# Altium schematic sheet living.SchDoc
size A3
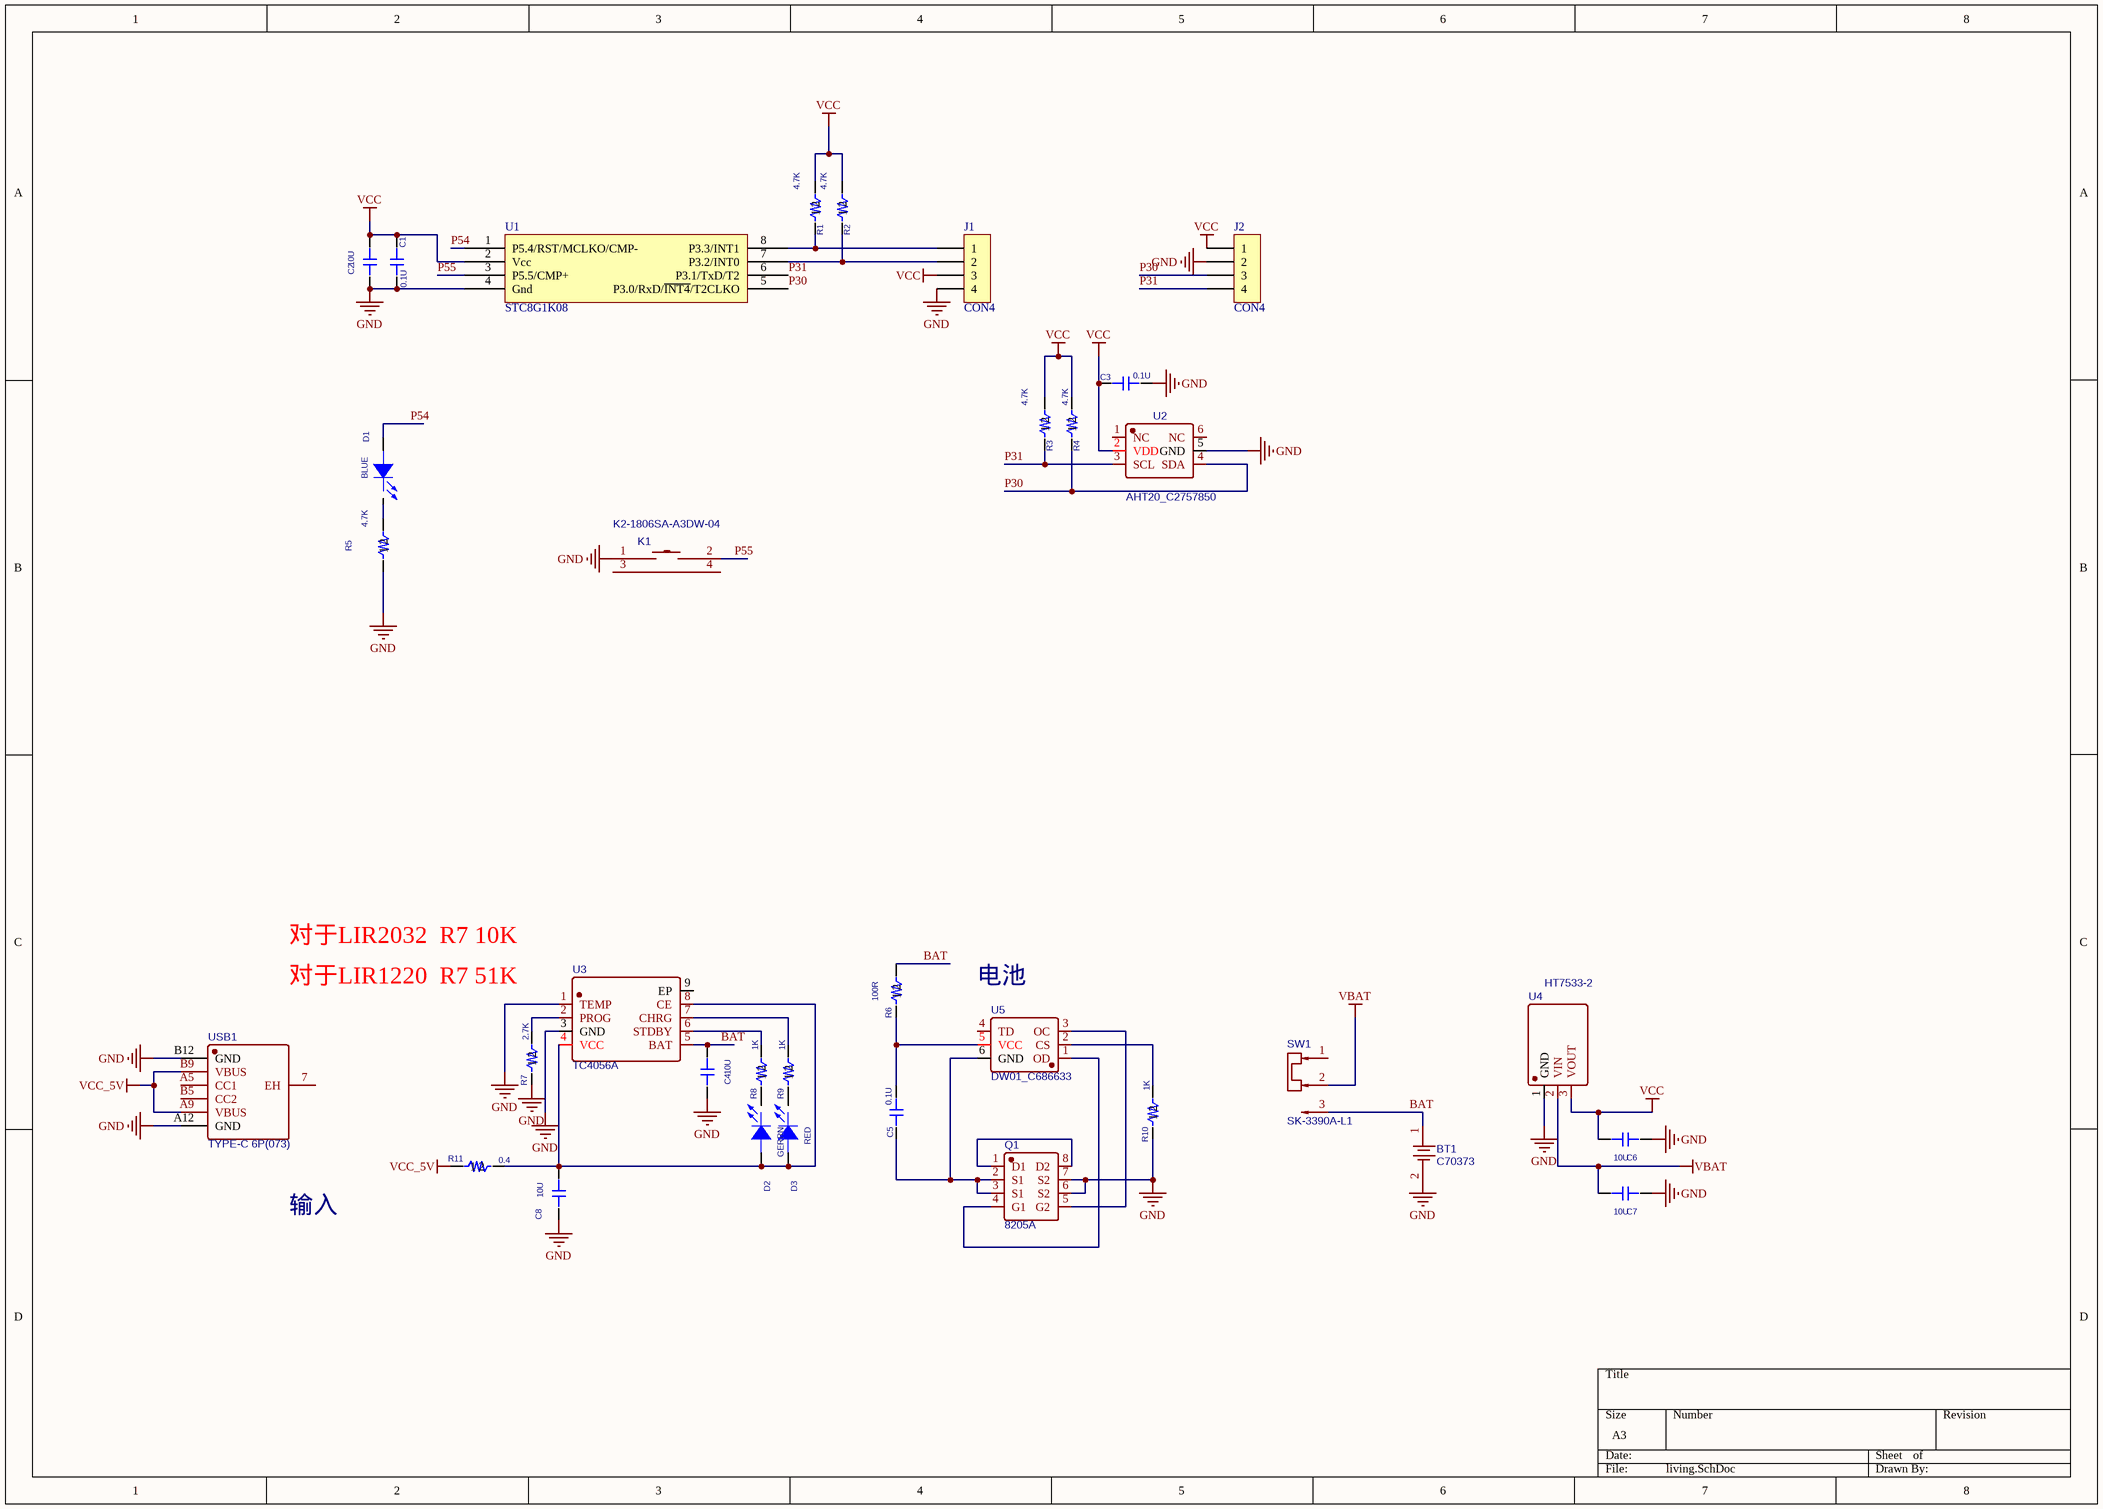
[diagram p0: living.SchDoc]

## Parts
BT1  C70373  [BAT-SMD_CR2032-3V]
C1  value 0.1U  [C_0603]  (hidden comment: C_0.1UF_0603)
C2  value 10U  [CAP_0603_FIRE]  (hidden comment: C_10UF_0603)
C3  value 0.1U  [C_0603]  (hidden comment: C_0.1UF_0603)
C4  value 10U  [CAP_0603_FIRE]  (hidden comment: C_10UF_0603)
C5  value 0.1U  [C_0603]  (hidden comment: C_0.1UF_0603)
C6  value 10U  [C_0603]  (hidden comment: C_10UF_0603)
C7  value 10U  [C_0603]  (hidden comment: C_10UF_0603)
C8  value 10U  [CAP_0603_FIRE]  (hidden comment: C_10UF_0603)
D1  value BLUE  [LED_BLUE_0603_FIRE]  (hidden comment: LED_BLUE_0603_FIRE)
D2  value GERRN  [LED_RED_0603_FIRE]  (hidden comment: LED_RED_0603_FIRE)
D3  value RED  [LED_RED_0603_FIRE]  (hidden comment: LED_RED_0603_FIRE)
J1  CON4  [SIP-4]
J2  CON4  [SIP-4]
K1  K2-1806SA-A3DW-04  [KEY-SMD_K2-1806SA-AXXW-XX]
Q1  8205A  [TSSOP-8_L4.4-W3.0-P0.65-LS6.4-BL]
R1  value 4.7K  [RES_0603_FIRE]  (hidden comment: RES_4K7_0603_FIRE)
R2  value 4.7K  [RES_0603_FIRE]  (hidden comment: RES_4K7_0603_FIRE)
R3  value 4.7K  [RES_0603_FIRE]  (hidden comment: RES_4K7_0603_FIRE)
R4  value 4.7K  [RES_0603_FIRE]  (hidden comment: RES_4K7_0603_FIRE)
R5  value 4.7K  [RES_0603_FIRE]  (hidden comment: RES_4K7_0603_FIRE)
R6  value 100R  [RES_0603_FIRE]  (hidden comment: RES_100R_0603_FIRE)
R7  value 2.7K  [R_0603]  (hidden comment: R_2.7K_0603)
R8  value 1K  [RES_0603_FIRE]  (hidden comment: RES_1K_0603_FIRE)
R9  value 1K  [RES_0603_FIRE]  (hidden comment: RES_1K_0603_FIRE)
R10  value 1K  [RES_0603_FIRE]  (hidden comment: RES_1K_0603_FIRE)
R11  value 0.4  [R_0603]  (hidden comment: R_2.7K_0603)
SW1  SK-3390A-L1  [SW-SMD_SK-3390A-L1]
U1  STC8G1K08  [SOP8]
U2  AHT20_C2757850  [SENSOR-SMD_L3.0-W3.0-P1.00-BR]
U3  TC4056A  [SOP-8_L4.9-W3.9-P1.27-LS6.0-BL-EP]
U4  HT7533-2  [SOT-89-3_L4.5-W2.5-P1.50-LS4.2-BR]
U5  DW01_C686633  [SOT-23-6_L2.9-W1.6-P0.95-LS2.8-BR]
USB1  TYPE-C 6P(073)  [TYPE-C-SMD_TYPE-C-6P]

## Nets
GND: BT1.2 C1.2 C2.1 C3.2 C4.1 C6.1 C7.1 C8.1 J1.4 J2.2 K1.1 Q1.6(S2) Q1.7(S2) R5.1 R7.1 R10.1 U1.4(Gnd) U2.5(GND) U3.1(TEMP) U3.3(GND) U4.1(GND) USB1.A12(GND) USB1.B12(GND)
VBAT: C7.2 SW1.2 U4.2(VIN)
VCC: C1.1 C2.2 C3.1 C6.2 J1.3 J2.1 R1.2 R2.2 R3.2 R4.2 U1.2(Vcc) U2.2(VDD) U4.3(VOUT)
VCC_5V: R11.1 USB1.A9(VBUS) USB1.B9(VBUS)
BAT: BT1.1 C4.2 R6.2 SW1.3 U3.5(BAT)
P30: J2.3 R4.1 U1.5(P3.0/RxD/~{INT4}/T2CLKO) U2.4(SDA)
P31: J2.4 R3.1 U1.6(P3.1/TxD/T2) U2.3(SCL)
P54: D1.A(ANODE) U1.1(P5.4/RST/MCLKO/CMP-)
P55: K1.2 U1.3(P5.5/CMP+)
NetC5_1: C5.1 Q1.2(S1) Q1.3(S1) U5.6(GND)
NetC5_2: C5.2 R6.1 U5.5(VCC)
NetC8_2: C8.2 D2.A(ANODE) D3.A(ANODE) R11.2 U3.4(VCC) U3.8(CE)
NetD1_K: D1.K(CATHODE) R5.2
NetD2_K: D2.K(CATHODE) R8.1
NetD3_K: D3.K(CATHODE) R9.1
NetJ1_1: J1.1 R1.1 U1.8(P3.3/INT1)
NetJ1_2: J1.2 R2.1 U1.7(P3.2/INT0)
NetQ1_1: Q1.1(D1) Q1.8(D2)
NetQ1_4: Q1.4(G1) U5.1(OD)
NetQ1_5: Q1.5(G2) U5.3(OC)
NetR7_2: R7.2 U3.2(PROG)
NetR8_2: R8.2 U3.6(STDBY)
NetR9_2: R9.2 U3.7(CHRG)
NetR10_2: R10.2 U5.2(CS)

Not connected (* = marked no-connect by the designer): K1 3 4; SW1 1; U2 1(NC) 6(NC); U3 9(EP); U5 4(TD); USB1 7(EH) A5(CC1) B5(CC2)

## Notes on the sheet
- 对于LIR2032  R7 10K
- 对于LIR1220  R7 51K
- (near U5) 电池
- 输入

## Library data of the parts
BT1 = C70373: BOM_Manufacturer: Q&J; Contributor: LCSC; BOM_Supplier: LCSC; BOM_Supplier Part: C70373; BOM_Manufacturer Part: C70373; BOM_JLCPCB Part Class: Extended Part; spicePre: B; spiceSymbolName: C70373
C6 C7 = C_10UF_0603: PCB DECAL: CAP_0603_FIRE
D1 = LED_BLUE_0603_FIRE: blue,0603; PCB DECAL: LED_BLUE_0603_FIRE
D3 = LED_RED_0603_FIRE: red,0805; PCB DECAL: LED_RED_0603_FIRE
J1 J2 = CON4: Connector
K1 = K2-1806SA-A3DW-04: Contributor: LCSC; BOM_Supplier: LCSC; BOM_Supplier Part: C2690015; BOM_Manufacturer Part: K2-1806SA-A3DW-04; BOM_JLCPCB Part Class: Extended Part; spicePre: S; spiceSymbolName: K2-1806SA-A3DW-04
Q1 = 8205A: BOM_Manufacturer: Hottech; Contributor: LCSC; SMT Type: Extend; BOM_Supplier: LCSC; BOM_Manufacturer Part: 8205A; BOM_Supplier Part: C181100; BOM_LCSC Assembly: Yes; spicePre: Q; spiceSymbolName: 8205A
R1-R5 = RES_4K7_0603_FIRE: 0402; Manufacture 1: SUPEROHM; Tolerance: +-5%; PCB DECAL: RES_0603_FIRE
R6 = RES_100R_0603_FIRE: 0402; Manufacture 1: SUPEROHM; Tolerance: +-5%; Assembly: SMD; PCB DECAL: RES_0603_FIRE
R8-R10 = RES_1K_0603_FIRE: 0402; Manufacture 1: SUPEROHM; Tolerance: +-5%; Assembly: SMD; PCB DECAL: RES_0603_FIRE
SW1 = SK-3390A-L1: BOM_Manufacturer: XKB Enterprise; Contributor: LCSC; BOM_Supplier: LCSC; BOM_Supplier Part: C319018; BOM_Manufacturer Part: SK-3390A-L1; BOM_JLCPCB Part Class: Extended Part; spicePre: S; spiceSymbolName: SK-3390A-L1
U1 = STC15W201S_SOP8
U2 = AHT20_C2757850: BOM_Manufacturer Part: AHT20; Contributor: LCSC; BOM_Supplier: LCSC; BOM_Supplier Part: C2757850; link: https://atta.szlcsc.com//upload/public/pdf/source/20200407/C503357_487829B2F97386053400E2E73B0ABB4D.pdf; BOM_JLCPCB Part Class: Extended Part; spicePre: U; spiceSymbolName: AHT20_C2757850
U3 = TC4056A: BOM_Manufacturer: FM; SMT Type: Extend; BOM_Supplier: LCSC; BOM_Manufacturer Part: TC4056A; BOM_Supplier Part: C84051; BOM_LCSC Assembly: Yes; spicePre: U; spiceSymbolName: TC4056A
U4 = HT7533-2: BOM_Manufacturer: HOLTEK; SMT Type: Extend; BOM_Supplier: LCSC; BOM_Manufacturer Part: HT7533-2; BOM_Supplier Part: C97849; BOM_LCSC Assembly: Yes; spicePre: U; spiceSymbolName: HT7533-2
U5 = DW01_C686633: BOM_Manufacturer: PJ(Pingjingsemi); BOM_Manufacturer Part: DW01; Contributor: LCSC; BOM_Supplier: LCSC; BOM_Supplier Part: C686633; spicePre: U; spiceSymbolName: DW01_C686633
USB1 = TYPE-C 6P(073): BOM_Manufacturer: SHOU HAN; Contributor: LCSC; BOM_Supplier: LCSC; BOM_Supplier Part: C668623; BOM_Manufacturer Part: TYPE-C 6P(073); BOM_JLCPCB Part Class: Extended Part; spicePre: U; spiceSymbolName: TYPE-C 6P(073)
C1 C3 C5 = C_0.1UF_0603: PCB DECAL: C_0603
C2 C4 C8 = C_10UF_0603: PCB DECAL: CAP_0603_FIRE
D2 = LED_RED_0603_FIRE: Description: red,0805; PCB DECAL: LED_RED_0603_FIRE
R7 R11 = R_2.7K_0603: PCB DECAL: R_0603